# EAGLE design Board (EAGLE 9.6.2)
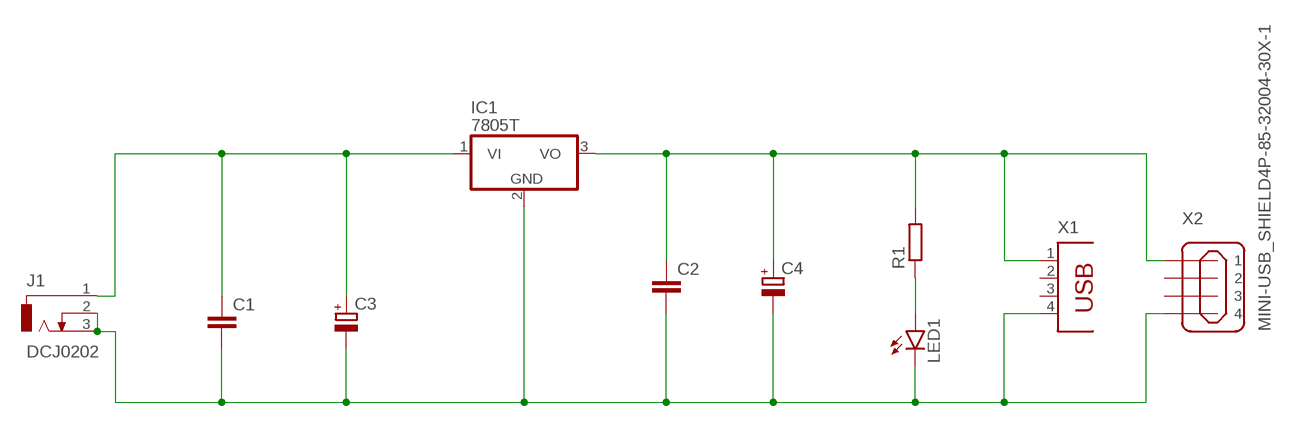
[diagram p0: schematic, sheet 1]

## Parts
C1  C-EU025-024X044  [C025-024X044]
C2  C-EU025-024X044  [C025-024X044]
C3  CPOL-EUB45181A  [B45181A]
C4  CPOL-EUB45181A  [B45181A]
IC1  7805T  [TO220H]
J1  DCJ0202  [DCJ0202]
LED1  LED5MM  [LED5MM]
R1  R-EU_0204/2V  [0204V]
X1  PN61729  [PN61729]
X2  MINI-USB_SHIELD4P-85-32004-30X-1  [85-32004-30X-1]

## Nets
N$1: C1.1 C3.+ IC1.1(VI) J1.1
N$2: C1.2 C2.2 C3.- C4.- IC1.2(GND) J1.2 J1.3 LED1.K(C) X1.4 X2.4
N$3: C2.1 C4.+ IC1.3(VO) R1.2 X1.1 X2.1
N$4: LED1.A R1.1
Unconnected: X1.2 X1.3 X2.2 X2.3 X2.M1(S1) X2.M2(S2)

## Library data of the parts
C1 C2 = rcl:C-EU: CAPACITOR, European symbol; SPICEPREFIX: C
C3 C4 = rcl:CPOL-EU: POLARIZED CAPACITOR, European symbol; SPICEPREFIX: C
IC1 = linear:78*: Positive VOLTAGE REGULATOR Source: http://cache.national.com/ds/LM/LM78L05.pdf http://www.fairchildsemi.com/ds/LM/LM7805.pdf
J1 = con-jack:DCJ0202: DC POWER JACK Source: DCJ0202.pdf; OC_FARNELL: unknown; OC_NEWARK: unknown
LED1 = led:LED: LED OSRAM: - CHIPLED LG R971, LG N971, LY N971, LG Q971, LY Q971, LO R971, LY R971 LH N974, LH R974 LS Q976, LO Q976, LY Q976 LO Q996 - Hyper CHIPLED LW Q18S LB Q993, LB Q99A, LB R99A - SideLED LS A670, LO A670, LY A670, LG A670, LP A670 LB A673, LV A673, LT A673, LW A673 LH A674 LY A675 LS A676, LA A676, LO A676, LY A676, LW A676 LS A679, LY A679, LG A679 - Hyper Micro SIDELED® LS Y876, LA Y876, LO Y876, LY Y876 LT Y87S - SmartLED LW L88C, LW L88S LB L89C, LB L89S, LG L890 LS L89K, LO L89K, LY L89K LS L896, LA L896, LO L896, LY L896 - TOPLED LS T670, LO T670, LY T670, LG T670, LP T670 LSG T670, LSP T670, LSY T670, LOP T670, LYG T670 LG T671, LOG T671, LSG T671 LB T673, LV T673, LT T673, LW T673 LH T674 LS T676, LA T676, LO T676, LY T676, LB T676, LH T676, LSB T676, LW T676 LB T67C, LV T67C, LT T67C, LS T67K, LO T67K, LY T67K, LW E67C LS E67B, LA E67B, LO E67B, LY E67B, LB E67C, LV E67C, LT E67C LW T67C LS T679, LY T679, LG T679 LS T770, LO T770, LY T770, LG T770, LP T770 LB T773, LV T773, LT T773, LW T773 LH T774 LS E675, LA E675, LY E675, LS T675 LS T776, LA T776, LO T776, LY T776, LB T776 LHGB T686 LT T68C, LB T68C - Hyper Mini TOPLED® LB M676 - Mini TOPLED Santana® LG M470 LS M47K, LO M47K, LY M47K Source: http://www.osram.convergy.de LUXEON: - LUMILED® LXK2-PW12-R00, LXK2-PW12-S00, LXK2-PW14-U00, LXK2-PW14-V00 LXK2-PM12-R00, LXK2-PM12-S00, LXK2-PM14-U00 LXK2-PE12-Q00, LXK2-PE12-R00, LXK2-PE12-S00, LXK2-PE14-T00, LXK2-PE14-U00 LXK2-PB12-K00, LXK2-PB12-L00, LXK2-PB12-M00, LXK2-PB14-N00, LXK2-PB14-P00, LXK2-PB14-Q00 LXK2-PR12-L00, LXK2-PR12-M00, LXK2-PR14-Q00, LXK2-PR14-R00 LXK2-PD12-Q00, LXK2-PD12-R00, LXK2-PD12-S00 LXK2-PH12-R00, LXK2-PH12-S00 LXK2-PL12-P00, LXK2-PL12-Q00, LXK2-PL12-R00 Source: www.luxeon.com KINGBRIGHT: KA-3528ASYC Source: www.kingbright.com
R1 = rcl:R-EU_: RESISTOR, European symbol; SPICEPREFIX: R
X1 = con-berg:PN61729: BERG USB connector; OC_FARNELL: unknown; OC_NEWARK: unknown
X2 = con-cypressindustries:MINI-USB_SHIELD4P-: MINI USB 4 Pol. Source: www.cypressindustries.com; OC_FARNELL: unknown; OC_NEWARK: unknown

## Board
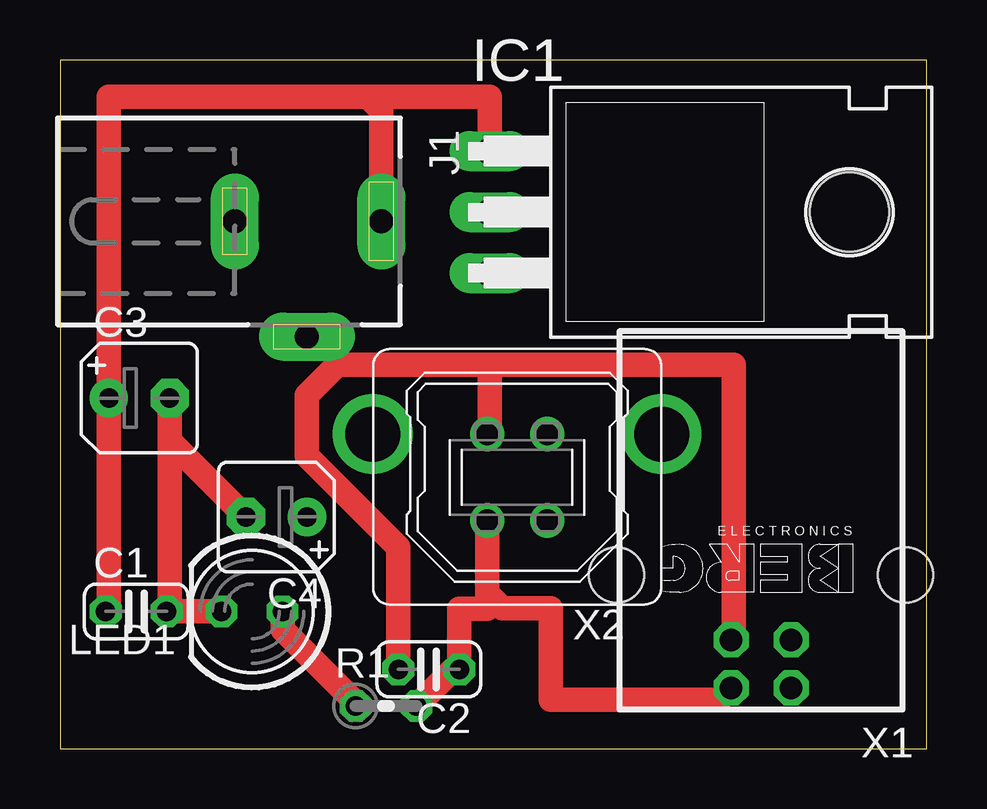
[diagram p1: board, top side]
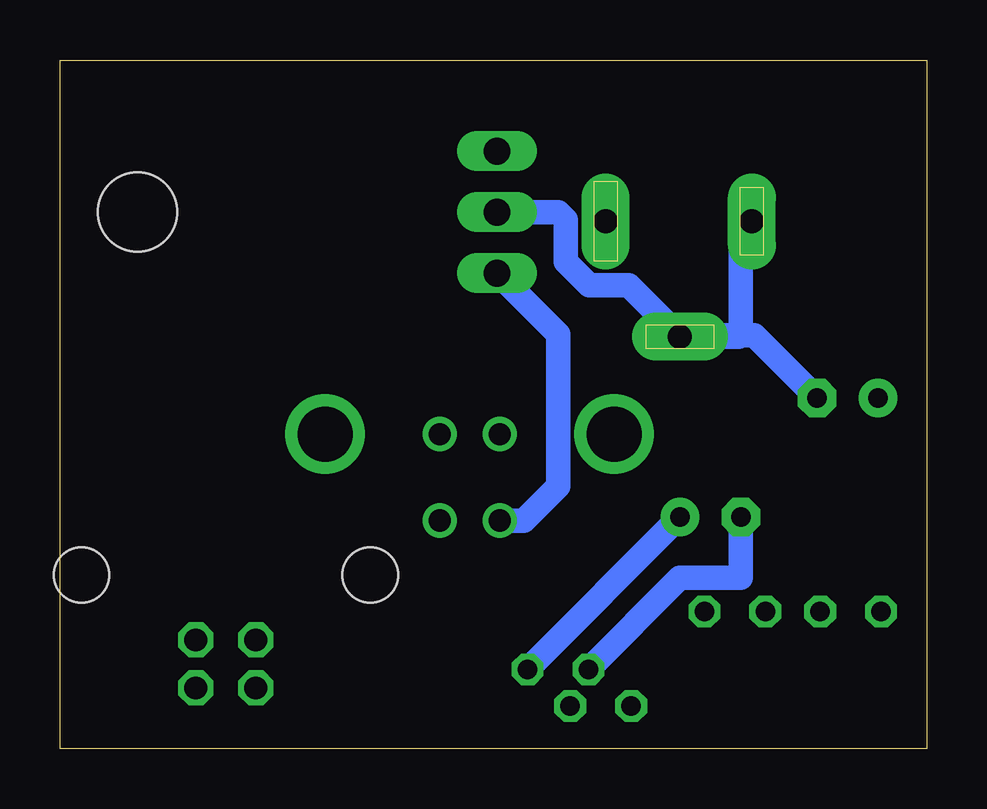
[diagram p2: board, bottom side, seen from below]

Size 36.12 x 28.69 mm. Coordinates in mm from the lower left corner, seen from the top.
Outline: 0,0 36.12,0 36.12,28.69 0,28.69 0,0
Copper layers (1*16): Top 0.035mm / dielectric 1.5mm / Bottom 0.035mm
Design rules "default": minimum track width 6mil, minimum drill 0.35mm, track to track 6mil, track to pad 6mil, pad to pad 6mil, via to via 6mil, smd to smd 6mil, copper to edge 40mil, drill to drill 6mil, minimum pad ring 10mil, minimum via ring 8mil, stop-mask expansion 4mil, vias tented up to drill 0mil, thermal gap 10mil

### Footprints (pad centres in the part's own frame; a part is rotated, then mirrored left to right if it is on the bottom)
C025-024X044 = drill 0.813 octagon: 1 -1.27,0; 2 1.27,0
B45181A = drill 0.813 pad 1.6: + -1.27,0 | drill 0.813 pad 1.6 octagon: - 1.27,0
TO220H = drill 1.118 long: 1 -2.54,-10.16; 2 0,-10.16; 3 2.54,-10.16 | hole 3.302: 0,4.826
DCJ0202 = drill 1 pad 2 long: 1 0,3.1; 2 4.8,0; 3 0,-3
LED5MM = drill 0.813 octagon: A -1.27,0; K 1.27,0
0204V = drill 0.813 octagon: 1 -1.27,0; 2 1.27,0
PN61729 = drill 0.95 octagon: 1 1.25,4.71; 2 -1.25,4.71; 3 -1.25,2.71; 4 1.25,2.71 | hole 2.3: -6.02,0; 6.02,0
85-32004-30X-1 = drill 0.92 pad 1.27: 1 1.25,1.8; 2 -1.25,1.8; 3 -1.25,-1.8; 4 1.25,-1.8 | drill 2.3 pad 3: M1 -6.02,-1.8; M2 6.02,-1.8

### Placement (x,y rotation side)
C1  3.17,5.72 0 top
C2  15.37,3.3 180 top
C3  3.3,14.61 0 top
C4  9.02,9.65 180 top
IC1  28.07,22.35 270 top
J1  10.29,21.97 270 top
LED1  8,5.72 180 top
R1  13.59,1.78 0 top
X1  29.21,7.24 180 top
X2  19.05,11.3 180 top

### Tracks (layer width: path | path; a pad name or v marks a point on that pad's centre or on a via)
N$1
  Top 1.016: IC1.1 17.91,27.17 12.83,27.17 | 12.83,27.17 2.03,27.17 C3.+ 2.03,5.84 C1.1 | J1.1 13.39,26.61 12.83,27.17
N$2
  Top 1.016: C4.- 4.57,12.83 C3.- 4.57,5.84 C1.2 LED1.K | C2.2 14.1,8.38 10.29,12.19 10.29,14.73 11.56,16 17.91,16 | 17.91,16 17.91,13.21 X2.4 | 17.91,16 28.07,16 28.07,4.64 X1.4
  Bottom 1.016: C4.- 7.75,7.11 10.29,7.11 C2.2 | IC1.2 15.37,22.35 15.05,22.03 15.05,20.28 14.08,19.31 12.43,19.31 10.34,17.22 | 10.34,17.22 J1.2 7.85,17.17 7.75,17.27 7.75,21.51 J1.3 | C3.- 7.19,17.22 10.34,17.22
N$3
  Top 1.016: R1.2 16.38,3.3 C2.1 16.64,5.82 17.8,5.82 X2.1 17.8,6.48 18.43,5.84 20.45,5.84 20.45,2.03 27.46,2.03 X1.1
  Bottom 1.016: C2.1 C4.+ | IC1.3 15.37,17.27 15.37,10.92 16.79,9.5 X2.1
N$4
  Top 1.016: R1.1 12.32,1.9 9.27,4.95 LED1.A